# EAGLE design expandio (EAGLE 5.07)
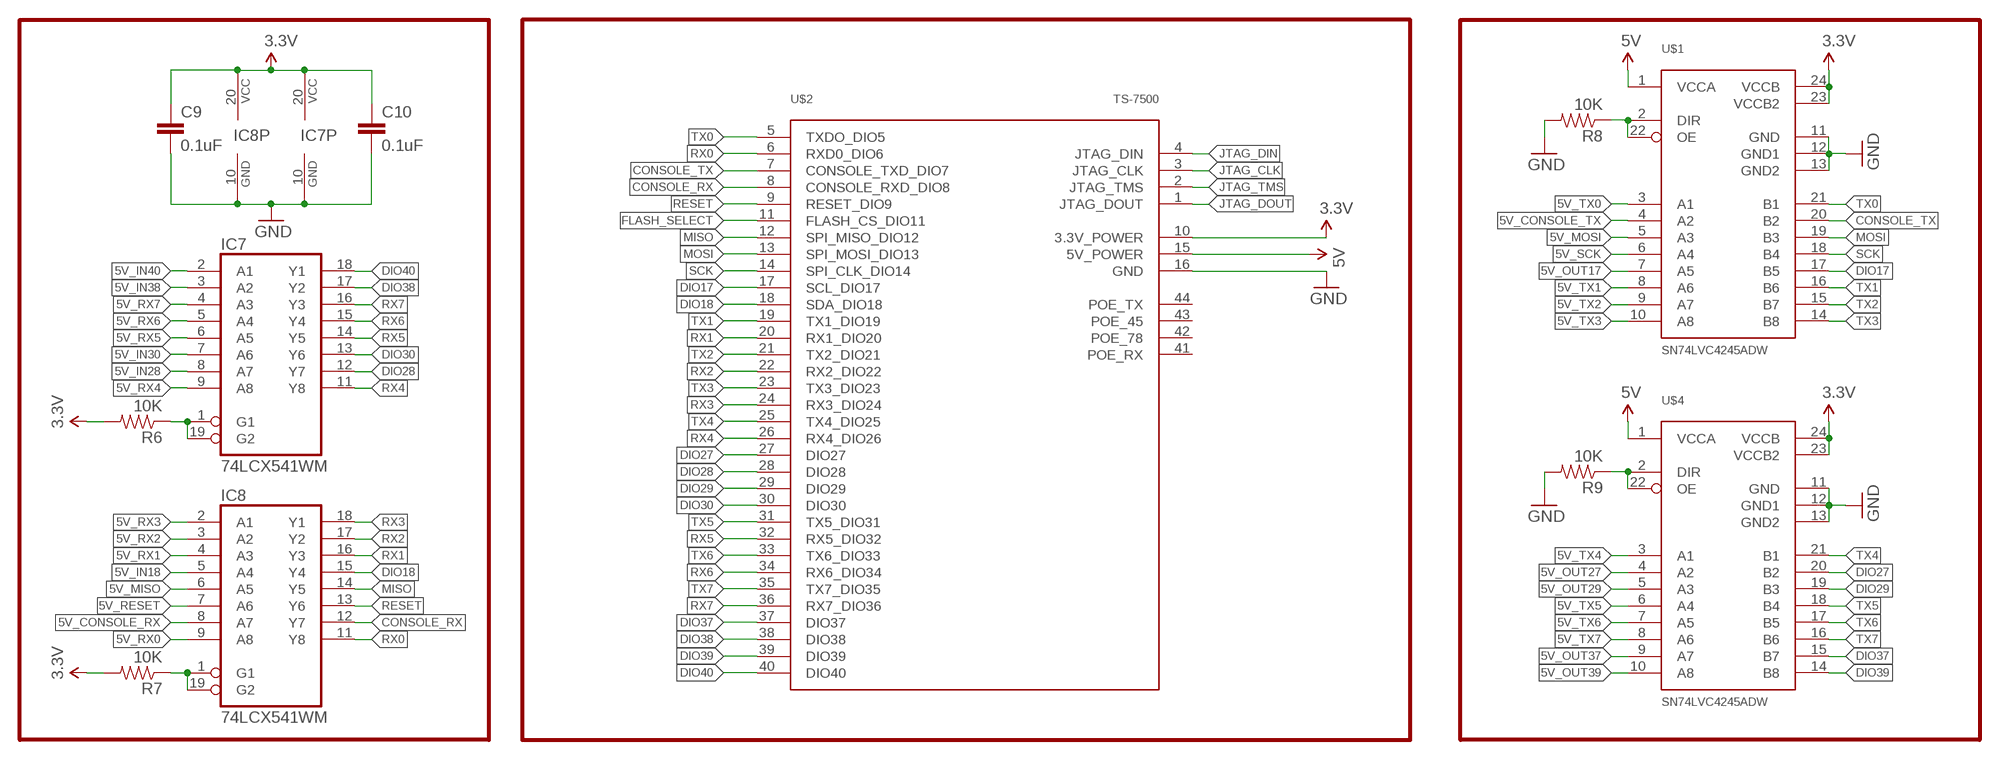
[diagram p0: schematic, sheet 1]

## Parts
C9  0.1uF  CAP0805  [0805]
C10  0.1uF  CAP0805  [0805]
IC7  74LCX541WM  74LS541DW  [SO20W]
IC8  74LCX541WM  74LS541DW  [SO20W]
R6  10K  RESISTOR  [0805]
R7  10K  RESISTOR  [0805]
R8  10K  RESISTOR  [0805]
R9  10K  RESISTOR  [0805]
U$1  SN74LVC4245ADW  [SO24W]
U$2  TS-7500  [TS-7500]
U$4  SN74LVC4245ADW  [SO24W]

## Nets
3.3V: C9.1 C10.1 IC7.20(VCC) IC8.20(VCC) R6.2 R7.2 U$1.23(VCCB2) U$1.24(VCCB) U$2.10(3.3V_POWER) U$4.23(VCCB2) U$4.24(VCCB)
5V: U$1.1(VCCA) U$2.15(5V_POWER) U$4.1(VCCA)
5V_CONSOLE_RX: IC8.8(A7)
5V_CONSOLE_TX: U$1.4(A2)
5V_IN18: IC8.5(A4)
5V_IN28: IC7.8(A7)
5V_IN30: IC7.7(A6)
5V_IN38: IC7.3(A2)
5V_IN40: IC7.2(A1)
5V_MISO: IC8.6(A5)
5V_MOSI: U$1.5(A3)
5V_OUT17: U$1.7(A5)
5V_OUT27: U$4.4(A2)
5V_OUT29: U$4.5(A3)
5V_OUT37: U$4.9(A7)
5V_OUT39: U$4.10(A8)
5V_RESET: IC8.7(A6)
5V_RX0: IC8.9(A8)
5V_RX1: IC8.4(A3)
5V_RX2: IC8.3(A2)
5V_RX3: IC8.2(A1)
5V_RX4: IC7.9(A8)
5V_RX5: IC7.6(A5)
5V_RX6: IC7.5(A4)
5V_RX7: IC7.4(A3)
5V_SCK: U$1.6(A4)
5V_TX0: U$1.3(A1)
5V_TX1: U$1.8(A6)
5V_TX2: U$1.9(A7)
5V_TX3: U$1.10(A8)
5V_TX4: U$4.3(A1)
5V_TX5: U$4.6(A4)
5V_TX6: U$4.7(A5)
5V_TX7: U$4.8(A6)
CONSOLE_RX: IC8.12(Y7) U$2.8(CONSOLE_RXD_DIO8)
CONSOLE_TX: U$1.20(B2) U$2.7(CONSOLE_TXD_DIO7)
DIO17: U$1.17(B5) U$2.17(SCL_DIO17)
DIO18: IC8.15(Y4) U$2.18(SDA_DIO18)
DIO27: U$2.27(DIO27) U$4.20(B2)
DIO28: IC7.12(Y7) U$2.28(DIO28)
DIO29: U$2.29(DIO29) U$4.19(B3)
DIO30: IC7.13(Y6) U$2.30(DIO30)
DIO37: U$2.37(DIO37) U$4.15(B7)
DIO38: IC7.17(Y2) U$2.38(DIO38)
DIO39: U$2.39(DIO39) U$4.14(B8)
DIO40: IC7.18(Y1) U$2.40(DIO40)
FLASH_SELECT: U$2.11(FLASH_CS_DIO11)
GND: C9.2 C10.2 IC7.10(GND) IC8.10(GND) R8.2 R9.2 U$1.11(GND) U$1.12(GND1) U$1.13(GND2) U$2.16(GND) U$4.11(GND) U$4.12(GND1) U$4.13(GND2)
JTAG_CLK: U$2.3(JTAG_CLK)
JTAG_DIN: U$2.4(JTAG_DIN)
JTAG_DOUT: U$2.1(JTAG_DOUT)
JTAG_TMS: U$2.2(JTAG_TMS)
MISO: IC8.14(Y5) U$2.12(SPI_MISO_DIO12)
MOSI: U$1.19(B3) U$2.13(SPI_MOSI_DIO13)
N$93: R8.1 U$1.2(DIR) U$1.22(OE)
N$94: R9.1 U$4.2(DIR) U$4.22(OE)
N$95: IC8.1(G1) IC8.19(G2) R7.1
N$96: IC7.1(G1) IC7.19(G2) R6.1
RESET: IC8.13(Y6) U$2.9(RESET_DIO9)
RX0: IC8.11(Y8) U$2.6(RXD0_DIO6)
RX1: IC8.16(Y3) U$2.20(RX1_DIO20)
RX2: IC8.17(Y2) U$2.22(RX2_DIO22)
RX3: IC8.18(Y1) U$2.24(RX3_DIO24)
RX4: IC7.11(Y8) U$2.26(RX4_DIO26)
RX5: IC7.14(Y5) U$2.32(RX5_DIO32)
RX6: IC7.15(Y4) U$2.34(RX6_DIO34)
RX7: IC7.16(Y3) U$2.36(RX7_DIO36)
SCK: U$1.18(B4) U$2.14(SPI_CLK_DIO14)
TX0: U$1.21(B1) U$2.5(TXDO_DIO5)
TX1: U$1.16(B6) U$2.19(TX1_DIO19)
TX2: U$1.15(B7) U$2.21(TX2_DIO21)
TX3: U$1.14(B8) U$2.23(TX3_DIO23)
TX4: U$2.25(TX4_DIO25) U$4.21(B1)
TX5: U$2.31(TX5_DIO31) U$4.18(B4)
TX6: U$2.33(TX6_DIO33) U$4.17(B5)
TX7: U$2.35(TX7_DIO35) U$4.16(B6)
Unconnected: U$2.41(POE_RX) U$2.42(POE_78) U$2.43(POE_45) U$2.44(POE_TX)

## Library data of the parts
C9 C10 = SparkFun:CAP: Capacitor Standard 0603 ceramic capacitor, and 0.1" leaded capacitor.
IC7 IC8 = 74xx-us:74*541: Octal BUFFER and LINE DRIVER, 3-state
R6-R9 = SparkFun:RESISTOR: Resistor Basic schematic elements and footprints for 0603, 1206, and PTH 1/10th watt (small) resistors.
U$1 U$4 = MakerBot:SN74LVC4245A
U$2 = MakerBot:TS-7500

## Board
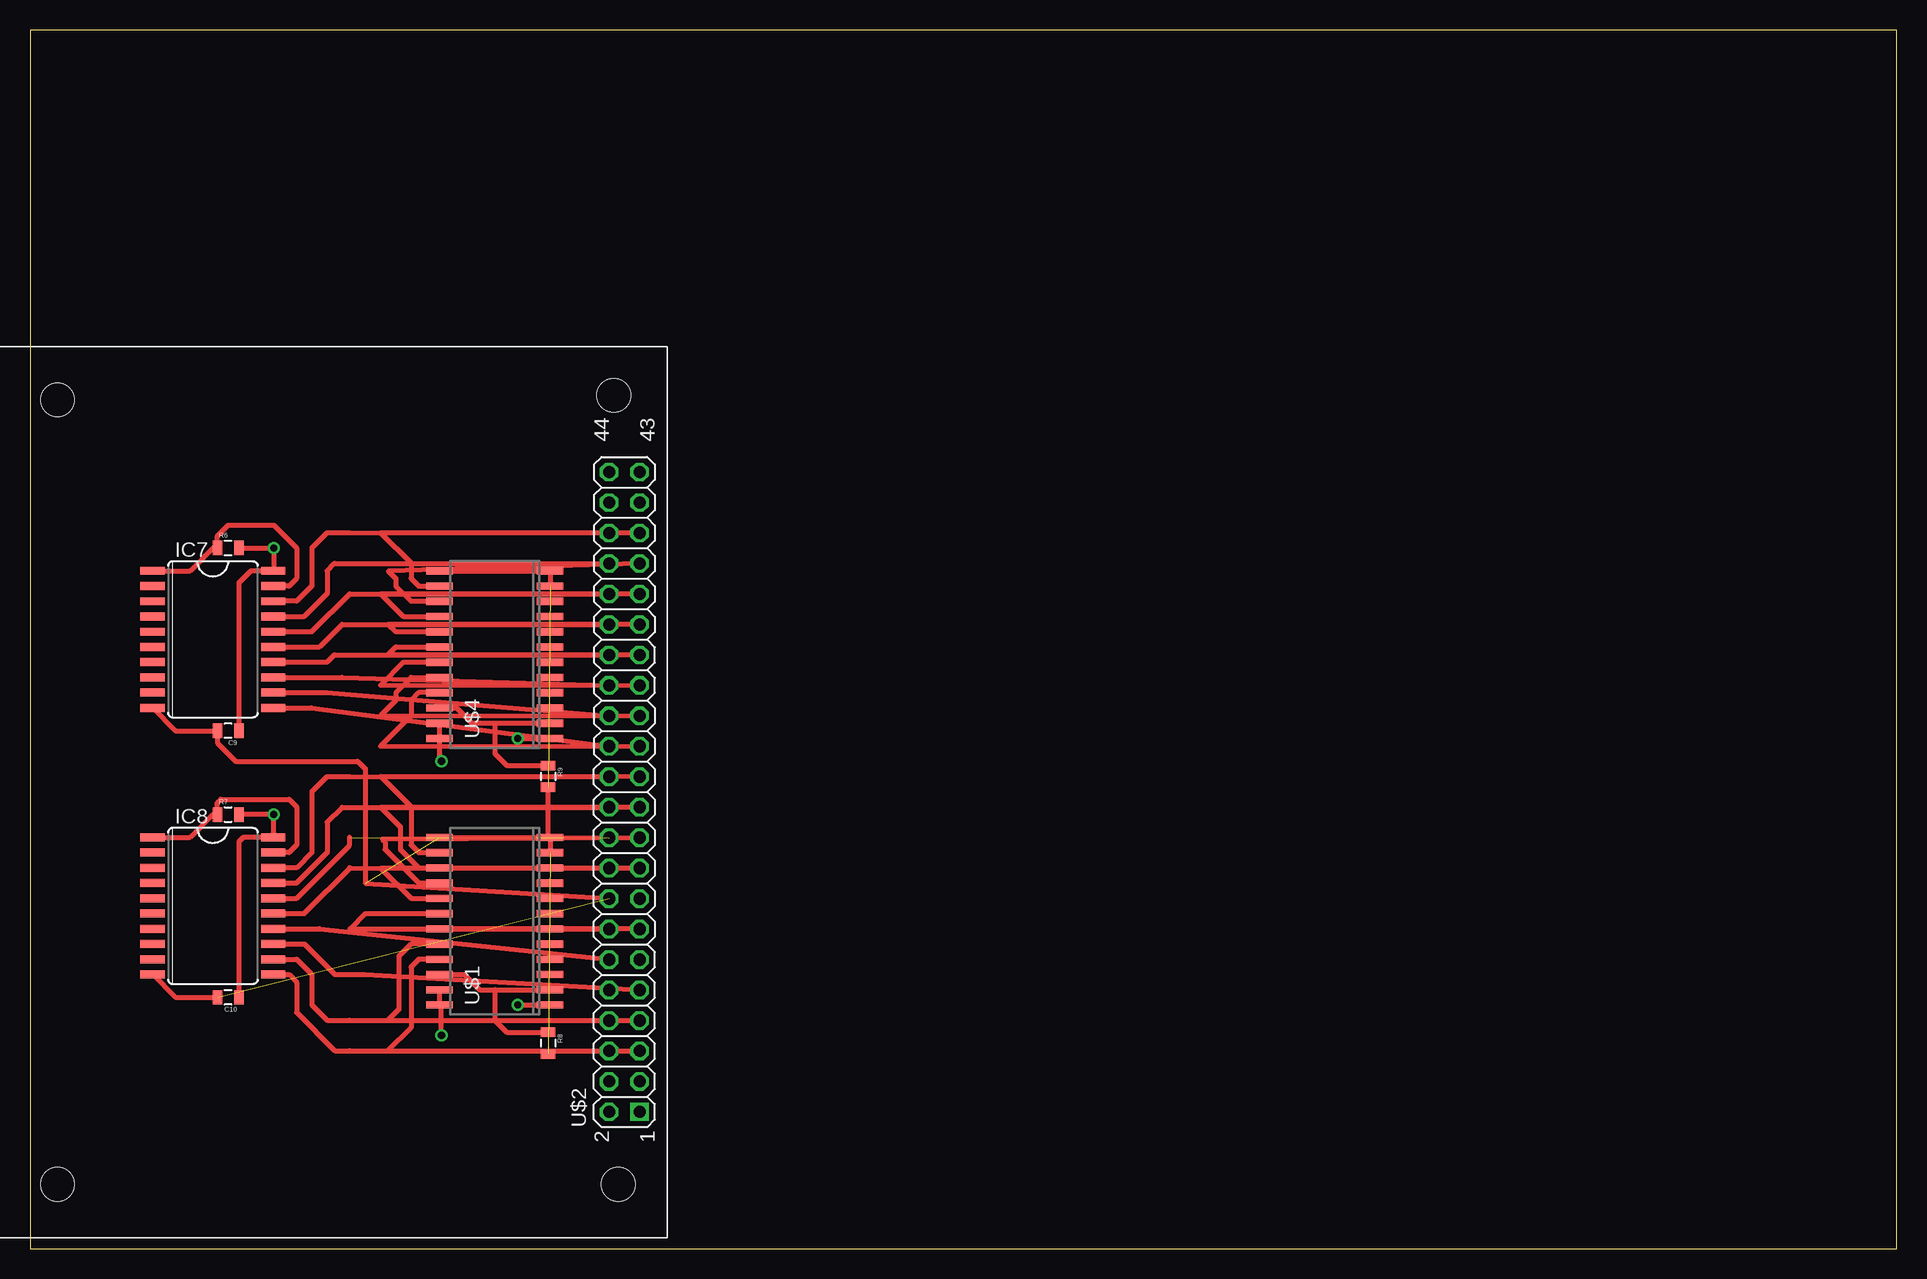
[diagram p1: board, top side]
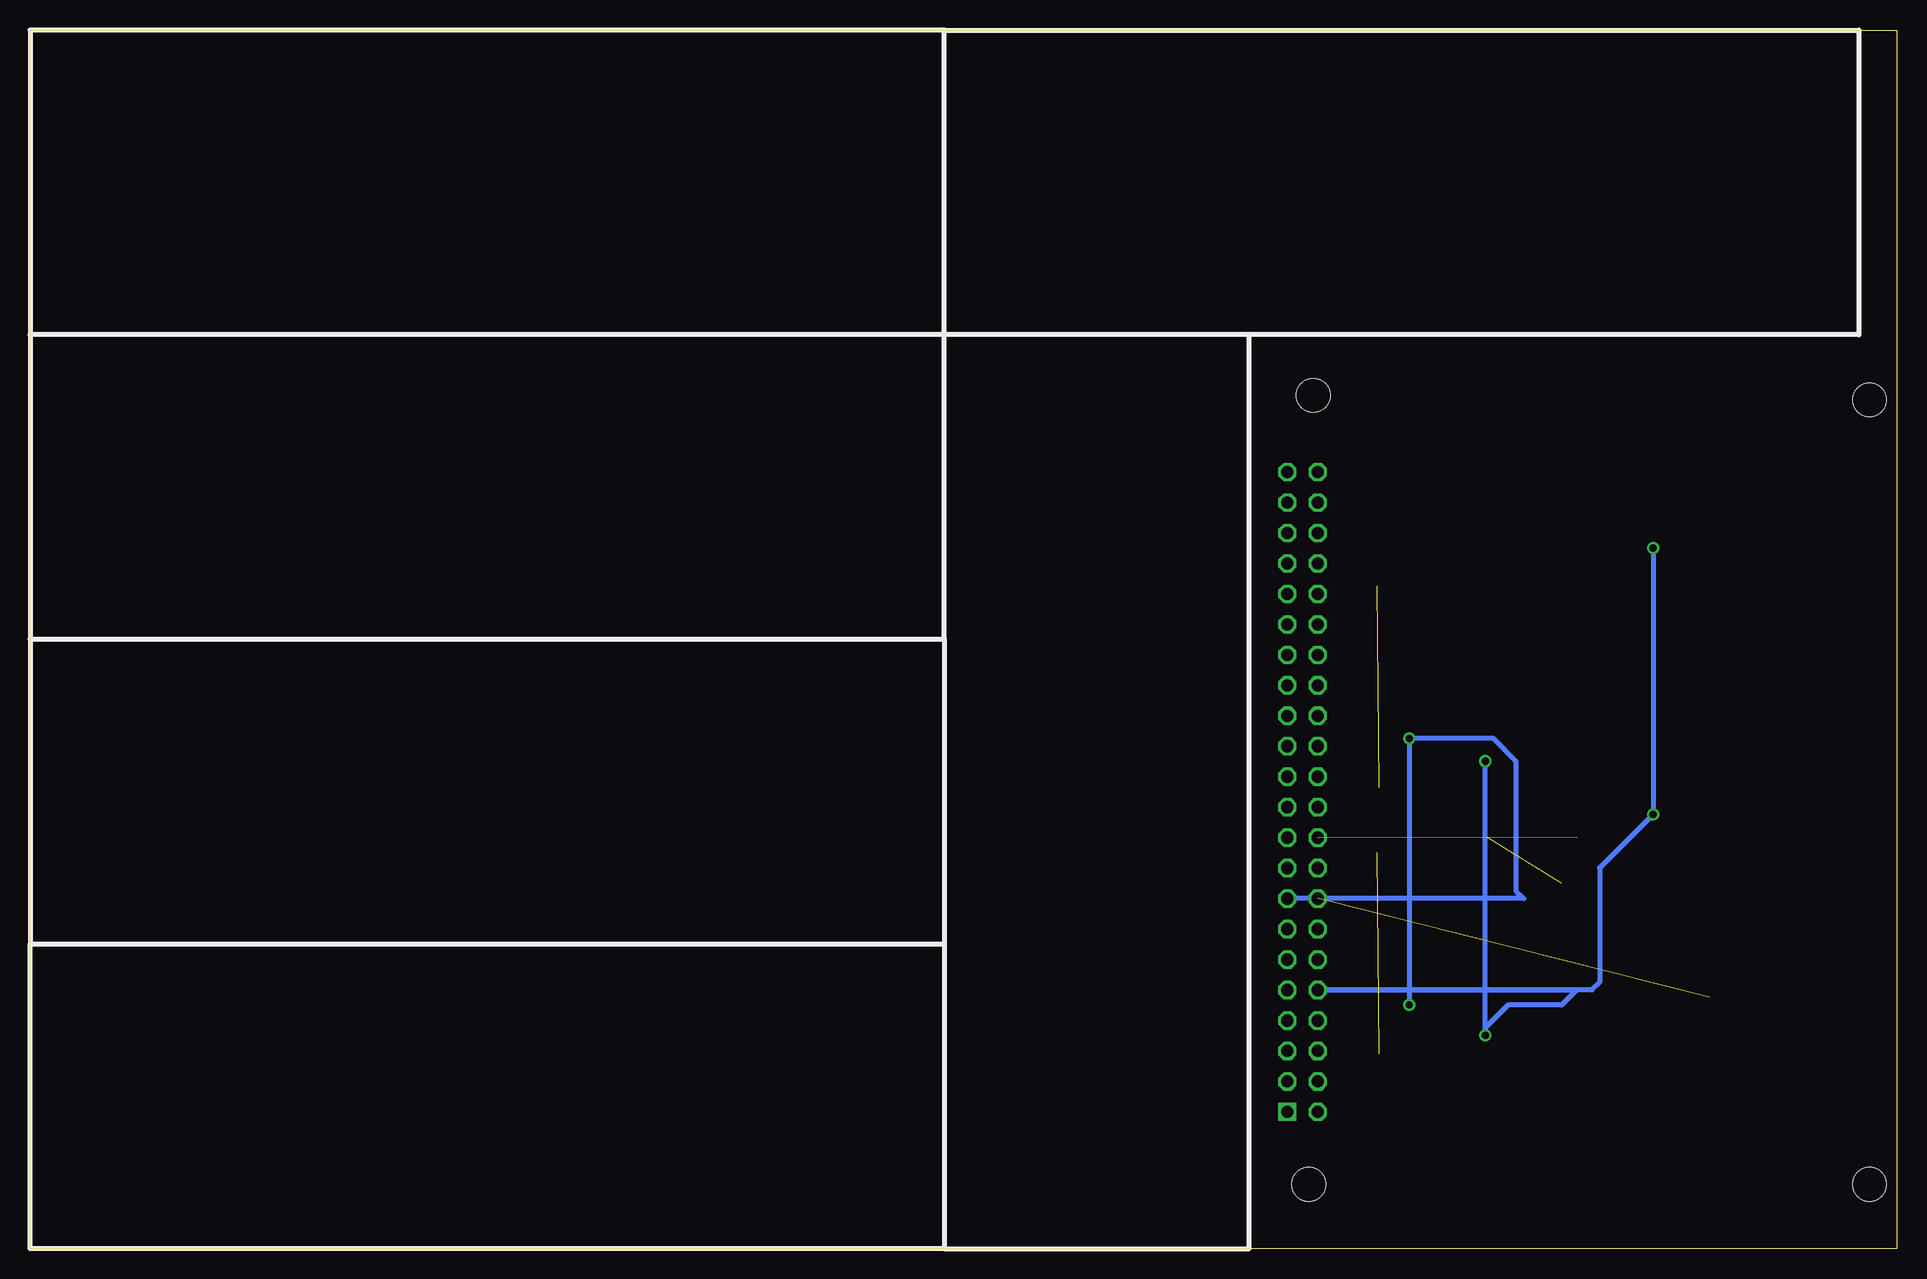
[diagram p2: board, bottom side, seen from below]

Size 155.57 x 101.6 mm. Coordinates in mm from the lower left corner, seen from the top.
Outline: 0,0 155.57,0 155.57,101.6 0,101.6 0,0
Copper layers (1*16): Top 0.035mm / dielectric 1.5mm / Bottom 0.035mm
Design rules "default": minimum track width 10mil, minimum drill 24mil, track to track 8mil, track to pad 8mil, pad to pad 8mil, via to via 8mil, smd to smd 8mil, copper to edge 40mil, drill to drill 8mil, minimum pad ring 10mil, minimum via ring 8mil, stop-mask expansion 4mil, vias tented up to drill 0mil, thermal gap 10mil

### Footprints (pad centres in the part's own frame; a part is rotated, then mirrored left to right if it is on the bottom)
0805 = smd 0.8 x 1.2: 1 -0.9,0; 2 0.9,0
SO20W = smd 0.66 x 2.032: 1 -5.715,-5.029; 2 -4.445,-5.029; 3 -3.175,-5.029; 4 -1.905,-5.029; 5 -0.635,-5.029; 6 0.635,-5.029; 7 1.905,-5.029; 8 3.175,-5.029; 9 4.445,-5.029; 10 5.715,-5.029; 11 5.715,5.029; 12 4.445,5.029; 13 3.175,5.029; 14 1.905,5.029; 15 0.635,5.029; 16 -0.635,5.029; 17 -1.905,5.029; 18 -3.175,5.029; 19 -4.445,5.029; 20 -5.715,5.029
SO24W = smd 0.6 x 2.2: 1 -6.985,-4.6; 2 -5.715,-4.6; 3 -4.445,-4.6; 4 -3.175,-4.6; 5 -1.905,-4.6; 6 -0.635,-4.6; 7 0.635,-4.6; 8 1.905,-4.6; 9 3.175,-4.6; 10 4.445,-4.6; 11 5.715,-4.6; 12 6.985,-4.6; 13 6.985,4.6; 14 5.715,4.6; 15 4.445,4.6; 16 3.175,4.6; 17 1.905,4.6; 18 0.635,4.6; 19 -0.635,4.6; 20 -1.905,4.6; 21 -3.175,4.6; 22 -4.445,4.6; 23 -5.715,4.6; 24 -6.985,4.6
TS-7500 = drill 1.016 square: 1 2.54,63.5 | drill 1.016 octagon: 2 5.08,63.5; 3 2.54,60.96; 4 5.08,60.96; 5 2.54,58.42; 6 5.08,58.42; 7 2.54,55.88; 8 5.08,55.88; 9 2.54,53.34; 10 5.08,53.34; 11 2.54,50.8; 12 5.08,50.8; 13 2.54,48.26; 14 5.08,48.26; 15 2.54,45.72; 16 5.08,45.72; 17 2.54,43.18; 18 5.08,43.18; 19 2.54,40.64; 20 5.08,40.64; 21 2.54,38.1; 22 5.08,38.1; 23 2.54,35.56; 24 5.08,35.56; 25 2.54,33.02; 26 5.08,33.02; 27 2.54,30.48; 28 5.08,30.48; 29 2.54,27.94; 30 5.08,27.94; 31 2.54,25.4; 32 5.08,25.4; 33 2.54,22.86; 34 5.08,22.86; 35 2.54,20.32; 36 5.08,20.32; 37 2.54,17.78; 38 5.08,17.78; 39 2.54,15.24; 40 5.08,15.24; 41 2.54,12.7; 42 5.08,12.7; 43 2.54,10.16; 44 5.08,10.16 | hole 2.8: 4.699,3.759; 51.054,4.14; 4.318,69.545; 51.054,69.545

### Placement (x,y rotation side)
C9  16.51,43.18 180 top
C10  16.51,20.95 180 top
IC7  15.24,50.8 270 top
IC8  15.24,28.57 270 top
R6  16.51,58.42 0 top
R7  16.51,36.2 0 top
R8  43.18,17.14 270 top
R9  43.18,39.37 270 top
U$1  38.73,27.3 90 top
U$2  53.34,74.9 180 top
U$4  38.73,49.53 90 top

### Tracks (layer width: path | path; a pad name or v marks a point on that pad's centre or on a via)
3.3V  (via drill 0.6)
  Top 0.406: R7.2 v20.32,36.2 20.27,36.14 IC8.20 17.78,34.29 17.41,33.92 C10.1 | R6.2 v20.32,58.42 20.32,56.57 IC7.20 18.41,56.52 17.41,55.51 C9.1 | v34.29,17.78 34.29,20.16 U$1.24 U$1.23 | U$4.23 U$4.24 34.13,40.8 v34.29,40.64
  Bottom 0.406: v20.32,58.42 v20.32,36.2 24.77,31.75 24.77,22.23 25.43,21.57 U$2.10 26.7,21.57 27.94,20.32 32.38,20.32 34.29,18.41 v34.29,17.78 v34.29,40.64
5V  (via drill 0.6)
  Top 0.406: v40.64,42.55 U$4.1 | v40.64,20.32 U$1.1
  Bottom 0.406: U$2.15 31.09,29.18 31.75,29.84 31.75,40.64 33.66,42.55 v40.64,42.55 v40.64,20.32
CONSOLE_RX
  Top 0.406: IC8.12 22.23,24.13 23.5,22.86 23.5,20.32 24.77,19.05 26.64,19.05 U$2.8
CONSOLE_TX
  Top 0.406: U$2.7 29.82,19.02 30.73,19.94 30.73,24.38 31.75,25.4 U$1.20
DIO17
  Top 0.406: U$2.17 29.23,31.73 31.75,29.21 U$1.17
DIO18
  Top 0.406: IC8.15 22.86,27.94 26.67,31.75 26.64,31.75 U$2.18
DIO27
  Top 0.406: U$2.27 29.21,44.45 30.48,45.72 30.48,46.35 31.75,47.62 U$4.20
DIO28
  Top 0.406: IC7.12 24.74,46.35 U$2.28
DIO29
  Top 0.406: U$2.29 29.21,46.99 31.11,48.9 U$4.19
DIO30
  Top 0.406: IC7.13 26.01,47.62 U$2.30
DIO37
  Top 0.406: U$2.37 29.87,56.49 30.48,55.88 30.48,55.24 31.75,53.98 U$4.15
DIO38
  Top 0.406: U$2.38 25.38,57.12 24.77,56.52 24.77,54.61 22.86,52.7 IC7.17
DIO39
  Top 0.406: U$2.39 29.23,59.66 31.75,57.15 31.75,55.88 32.38,55.24 U$4.14
DIO40
  Top 0.406: IC7.18 22.23,53.98 23.5,55.24 23.5,58.42 24.77,59.69 26.64,59.69 U$2.40
GND  (4 unrouted)
  Top 0.406: IC7.10 12.12,43.18 C9.2 15.61,42.17 17.14,40.64 27.3,40.64 27.94,40.01 27.94,30.45 U$2.16 | C10.2 12.12,20.95 IC8.10 | U$4.11 U$4.12 U$4.13 | U$1.12 U$1.11 | U$1.13 U$1.12 | R9.2 43.18,34.45 U$1.12
MISO
  Top 0.406: IC8.14 24.11,26.67 U$2.12
MOSI
  Top 0.406: U$2.13 34.11,26.64 U$1.19
N$93
  Top 0.406: U$1.22 36.2,22.86 37.47,21.59 38.73,21.59 | 38.73,21.59 U$1.2 | R8.1 39.74,18.05 38.73,19.05 38.73,21.59
N$94
  Top 0.406: U$4.22 35.56,45.09 36.83,43.81 38.73,43.81 | 38.73,43.81 U$4.2 | R9.1 39.74,40.27 38.73,41.27 38.73,43.81
N$95
  Top 0.406: IC8.1 13.34,34.29 15.24,36.2 R7.1 15.61,37.2 15.88,37.47 21.59,37.47 22.23,36.83 22.23,33.66 21.59,33.02 IC8.19
N$96
  Top 0.406: IC7.1 13.34,56.52 15.24,58.42 R6.1 15.61,59.42 16.51,60.33 20.32,60.33 22.23,58.42 22.23,55.88 21.59,55.24 IC7.19
RESET
  Top 0.406: IC8.13 22.86,25.4 25.4,22.86 27.91,22.86 U$2.9
RX0
  Top 0.406: IC8.11 21.59,22.86 22.23,22.23 22.23,19.68 25.4,16.51 26.64,16.51 U$2.6
RX1  (1 unrouted)
  Top 0.406: IC8.16 22.23,29.21 26.64,33.63 26.64,34.29
RX2
  Top 0.406: U$2.22 26.01,36.8 24.77,35.56 24.77,33.02 22.23,30.48 IC8.17
RX3
  Top 0.406: IC8.18 22.23,31.75 23.5,33.02 23.5,38.1 24.77,39.37 26.64,39.37 U$2.24
RX4
  Top 0.406: IC7.11 23.47,45.09 U$2.26
RX5
  Top 0.406: U$2.32 25.38,49.51 24.77,48.9 IC7.14
RX6
  Top 0.406: U$2.34 26.01,52.05 24.13,50.16 IC7.15
RX7
  Top 0.406: U$2.36 26.64,54.59 23.5,51.44 IC7.16
SCK
  Top 0.406: U$2.14 26.67,26.67 27.94,27.94 U$1.18
TX0
  Top 0.406: U$2.5 29.82,16.48 31.75,18.41 31.75,23.5 32.38,24.13 U$1.21
TX1
  Top 0.406: U$2.19 29.36,34.14 29.59,33.91 29.59,33.27 32.38,30.48 U$1.16
TX2
  Top 0.406: U$2.21 29.23,36.8 30.86,35.18 30.86,33.27 32.38,31.75 U$1.15
TX3
  Top 0.406: U$2.23 29.21,39.37 31.75,36.83 31.75,33.66 32.38,33.02 U$1.14
TX4
  Top 0.406: U$2.25 29.21,41.91 31.75,44.45 31.75,45.72 32.38,46.35 U$4.21
TX5
  Top 0.406: U$2.31 29.82,49.51 30.48,50.16 U$4.18
TX6
  Top 0.406: U$2.33 29.87,52.05 30.48,51.44 U$4.17
TX7
  Top 0.406: U$2.35 29.23,54.59 31.11,52.7 U$4.16